# Altium schematic sheet 2-PWR_MANAGE.SchDoc
size A4
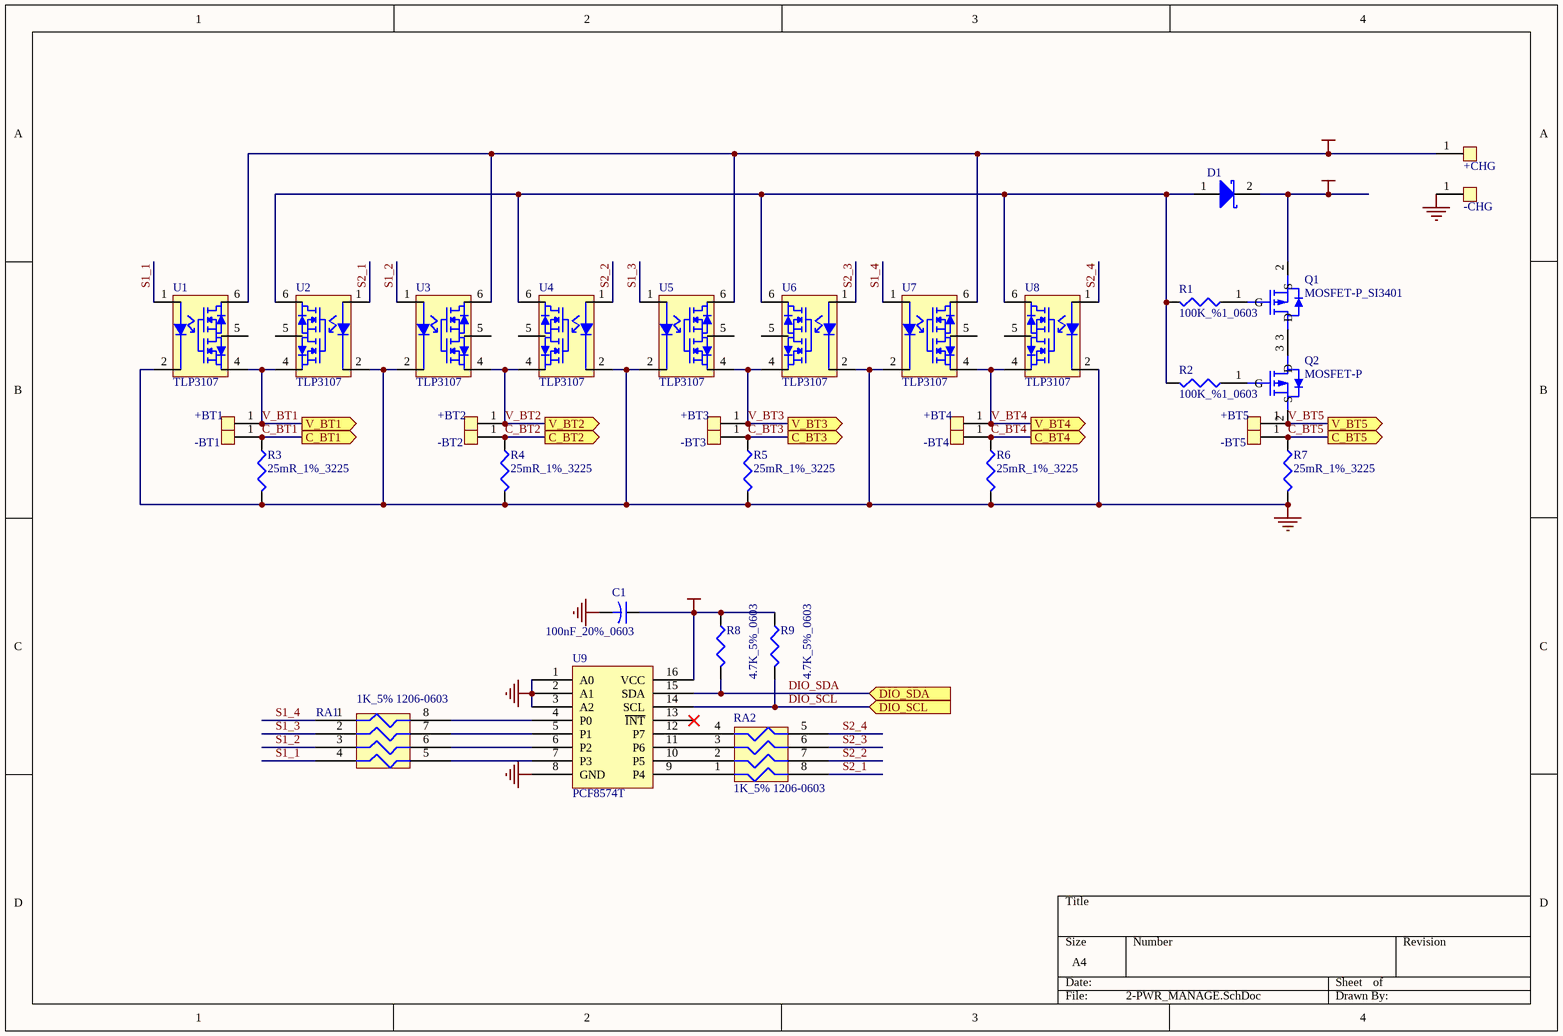
[diagram p0: 2-PWR_MANAGE.SchDoc]

## Parts
+BT1  ND  [END_1.5_2.2]  (value not drawn)
+BT2  ND  [END_1.5_2.2]  (value not drawn)
+BT3  ND  [END_1.5_2.2]  (value not drawn)
+BT4  ND  [END_1.5_2.2]  (value not drawn)
+BT5  ND  [END_1.5_2.2]  (value not drawn)
+CHG  ND  [END_1.5_2.2]  (value not drawn)
-BT1  ND  [END_1.5_2.2]  (value not drawn)
-BT2  ND  [END_1.5_2.2]  (value not drawn)
-BT3  ND  [END_1.5_2.2]  (value not drawn)
-BT4  ND  [END_1.5_2.2]  (value not drawn)
-BT5  ND  [END_1.5_2.2]  (value not drawn)
-CHG  ND  [END_1.5_2.2]  (value not drawn)
C1  100nF_20%_0603  [C1608-0603]
D1  D Schottky  [DO-214AA_785X100_200X160A100L_P]  (value not drawn)
Q1  MOSFET-P_SI3401  [SO-G3/C2.5]
Q2  MOSFET-P  [SO-G3/C2.5]
R1  value 100K_%1_0603  [C1608-0603]  (hidden comment: Res3)
R2  value 100K_%1_0603  [C1608-0603]  (hidden comment: Res3)
R3  25mR_1%_3225  [CR6332-2512]
R4  25mR_1%_3225  [CR6332-2512]
R5  25mR_1%_3225  [CR6332-2512]
R6  25mR_1%_3225  [CR6332-2512]
R7  25mR_1%_3225  [CR6332-2512]
R8  4.7K_5%_0603  [C1608-0603]
R9  4.7K_5%_0603  [C1608-0603]
RA1  1K_5% 1206-0603  [RCA-4]
RA2  1K_5% 1206-0603  [RCA-4]
U1  TLP3107  [SO-6_P2.54_B7]
U2  TLP3107  [SO-6_P2.54_B7]
U3  TLP3107  [SO-6_P2.54_B7]
U4  TLP3107  [SO-6_P2.54_B7]
U5  TLP3107  [SO-6_P2.54_B7]
U6  TLP3107  [SO-6_P2.54_B7]
U7  TLP3107  [SO-6_P2.54_B7]
U8  TLP3107  [SO-6_P2.54_B7]
U9  PCF8574T  [SOP16_P1.27_B10]

## Ports
C_BT1 (out), C_BT2 (out), C_BT3 (out), C_BT4 (out), C_BT5 (out), DIO_SCL (in), DIO_SDA (in), V_BT1 (out), V_BT2 (out), V_BT3 (out), V_BT4 (out), V_BT5 (out)

## Nets
GND: -CHG.1(SW) C1.2 R3.2 R4.2 R5.2 R6.2 R7.2 U1.2(K) U2.2(K) U3.2(K) U4.2(K) U5.2(K) U6.2(K) U7.2(K) U8.2(K) U9.1(A0) U9.2(A1) U9.3(A2) U9.8(GND)
VCC_3V3: C1.1 R8.1 R9.1 U9.16(VCC)
VCC_BAT: D1.2(K) Q1.2(S)
VCC_CHARGE: +CHG.1(SW) U1.6(A1) U3.6(A1) U5.6(A1) U7.6(A1)
C_BT1: -BT1.1(SW) R3.1 ; port C_BT1
C_BT2: -BT2.1(SW) R4.1 ; port C_BT2
C_BT3: -BT3.1(SW) R5.1 ; port C_BT3
C_BT4: -BT4.1(SW) R6.1 ; port C_BT4
C_BT5: -BT5.1(SW) R7.1 ; port C_BT5
DIO_SCL: R9.2 U9.14(SCL) ; port DIO_SCL
DIO_SDA: R8.2 U9.15(SDA) ; port DIO_SDA
S1_1: RA1.4 U1.1(A)
S1_2: RA1.3 U3.1(A)
S1_3: RA1.2 U5.1(A)
S1_4: RA1.1 U7.1(A)
S2_1: RA2.8 U2.1(A)
S2_2: RA2.7 U4.1(A)
S2_3: RA2.6 U6.1(A)
S2_4: RA2.5 U8.1(A)
V_BT1: +BT1.1(SW) U1.4(A2) U2.4(A2) ; port V_BT1
V_BT2: +BT2.1(SW) U3.4(A2) U4.4(A2) ; port V_BT2
V_BT3: +BT3.1(SW) U5.4(A2) U6.4(A2) ; port V_BT3
V_BT4: +BT4.1(SW) U7.4(A2) U8.4(A2) ; port V_BT4
V_BT5: +BT5.1(SW) Q2.2(S) ; port V_BT5
NetD1_1: D1.1(A) R1.2 R2.2 U2.6(A1) U4.6(A1) U6.6(A1) U8.6(A1)
NetQ1_1: Q1.1(G) R1.1
NetQ1_3: Q1.3(D) Q2.3(D)
NetQ2_1: Q2.1(G) R2.1
NetRA1_5: RA1.5 U9.7(P3)
NetRA1_6: RA1.6 U9.6(P2)
NetRA1_7: RA1.7 U9.5(P1)
NetRA1_8: RA1.8 U9.4(P0)
NetRA2_1: RA2.1 U9.9(P4)
NetRA2_2: RA2.2 U9.10(P5)
NetRA2_3: RA2.3 U9.11(P6)
NetRA2_4: RA2.4 U9.12(P7)

Not connected (* = marked no-connect by the designer): U1 3(NC) 5(+); U2 3(NC) 5(+); U3 3(NC) 5(+); U4 3(NC) 5(+); U5 3(NC) 5(+); U6 3(NC) 5(+); U7 3(NC) 5(+); U8 3(NC) 5(+); U9 13(~{INT})*

## Library data of the parts
C1 = Cap2: Capacitor; Value: 0.1uF; Published: 23-Sep-2002; Publisher: Altium Limited
D1 = D Schottky: Schottky Diode; Code - JEDEC: DO-214-AA; Published: 8-Jun-2000; Revision: July-2002: Re-released for DXP Platform.; Publisher: Altium Limited
Q1 = MOSFET-P
R1 R2 = Res3: Resistor; Published: 8-Jun-2000; Revision: July-2002: Re-released for DXP Platform.; Publisher: Altium Limited
R3-R7 = Res3: Resistor; Value: 150R %5 0603; Published: 8-Jun-2000; Revision: July-2002: Re-released for DXP Platform.; Publisher: Altium Limited
R8 R9 = Res3: Resistor; Value: 1K%5 0603; Published: 8-Jun-2000; Revision: July-2002: Re-released for DXP Platform.; Publisher: Altium Limited
RA1 RA2 = RESPACK1X4